# Altium schematic sheet Sheet1.SchDoc: solar-powered-remote-water-level-relay
size 419 x 297 mm; Date: 2026/06/29; Author: forlook88@gmail.com; Revision: 0; SheetNumber: 1; SheetTotal: 11
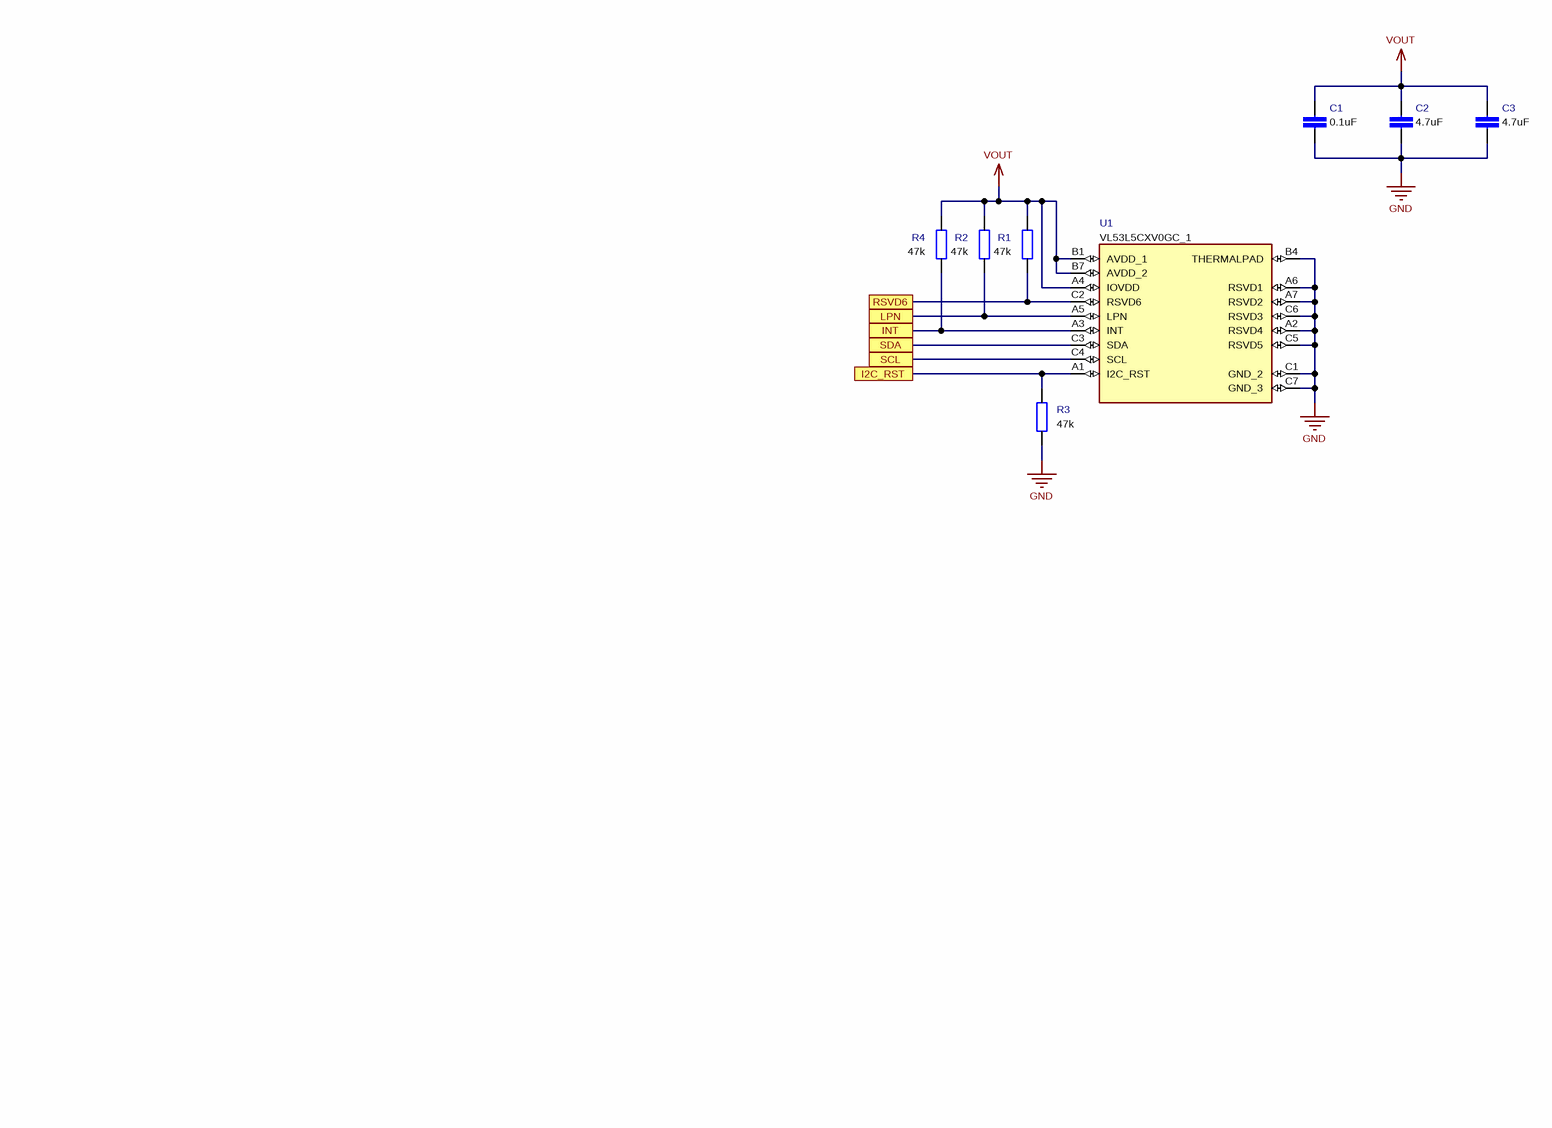
[diagram p0: Sheet1.SchDoc]

## Parts
C1  value 0.1uF
C2  value 4.7uF
C3  value 4.7uF
R1  value 47k
R2  value 47k
R3  value 47k
R4  value 47k
U1  value VL53L5CXV0GC_1

## Ports
I2C_RST, INT, LPN, RSVD6, SCL, SDA

## Nets
GND: C1.2 C2.2 C3.2 R3.1 U1.A2(RSVD4) U1.A6(RSVD1) U1.A7(RSVD2) U1.B4(THERMALPAD) U1.C1(GND_2) U1.C5(RSVD5) U1.C6(RSVD3) U1.C7(GND_3)
VOUT: C1.1 C2.1 C3.1 R1.1 R2.1 R4.1 U1.A4(IOVDD) U1.B1(AVDD_1) U1.B7(AVDD_2)
I2C_RST: R3.2 U1.A1(I2C_RST) ; port I2C_RST
INT: R4.2 U1.A3(INT) ; port INT
LPN: R2.2 U1.A5(LPN) ; port LPN
RSVD6: R1.2 U1.C2(RSVD6) ; port RSVD6
SCL: U1.C4(SCL) ; port SCL
SDA: U1.C3(SDA) ; port SDA

## Notes on the sheet
- Document Name:
- Project Name:
- Sheet Name:
- Sheet Number:
- Author:
- CELUS Design Platform electronic designs are machine-generated drafts and require verification by qualified specialists.
- of
- Revision:
- Date:
- By using these designs, you agree to the CELUS Terms of Use: https://www.celus.io/terms-of-use

## Library data of the parts
C1 = (no symbol name): Manufacturer Part Number: 0402ZD104KAT2A; Manufacturer: KYOCERA AVX
C2 C3 = (no symbol name): Manufacturer Part Number: GRM188R61E475KE11D; Manufacturer: Murata
R1-R4 = (no symbol name): Manufacturer Part Number: CRCW060347K0FKEA; Manufacturer: Vishay
U1 = (no symbol name): Manufacturer: STMicroelectronics; Manufacturer Part Number: VL53L5CXV0GC_1